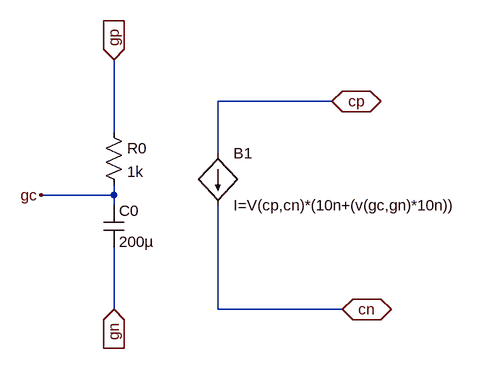
[diagram p0: schematic CapteurGraphene.asc]
CapteurGraphene.asc, the LTspice schematic file:
Version 4
SHEET 1 880 680
WIRE 528 32 352 32
WIRE 192 80 192 -32
WIRE 352 112 352 32
WIRE 192 176 192 160
WIRE 192 176 80 176
WIRE 192 192 192 176
WIRE 192 352 192 256
WIRE 352 352 352 192
WIRE 544 352 352 352
FLAG 192 -32 gp
IOPIN 192 -32 In
FLAG 192 352 gn
IOPIN 192 352 In
FLAG 528 32 cp
IOPIN 528 32 BiDir
FLAG 544 352 cn
IOPIN 544 352 BiDir
FLAG 80 176 gc
SYMBOL res 176 64 R0
SYMATTR InstName R0
SYMATTR Value 1k
SYMBOL cap 176 192 R0
SYMATTR InstName C0
SYMATTR Value 200µ
SYMBOL bi 352 112 R0
SYMATTR InstName B1
SYMATTR Value I=V(cp,cn)*(10n+(v(gc,gn)*10n))

The netlist it stands for:
* CapteurGraphene.asc
R0 gp gc 1k
C0 gc gn 200µ
B1 cp cn I=V(cp,cn)*(10n+(v(gc,gn)*10n))
.backanno
.end